# EAGLE board NS_Integrator (EAGLE 9.5.1), part 1 of 2
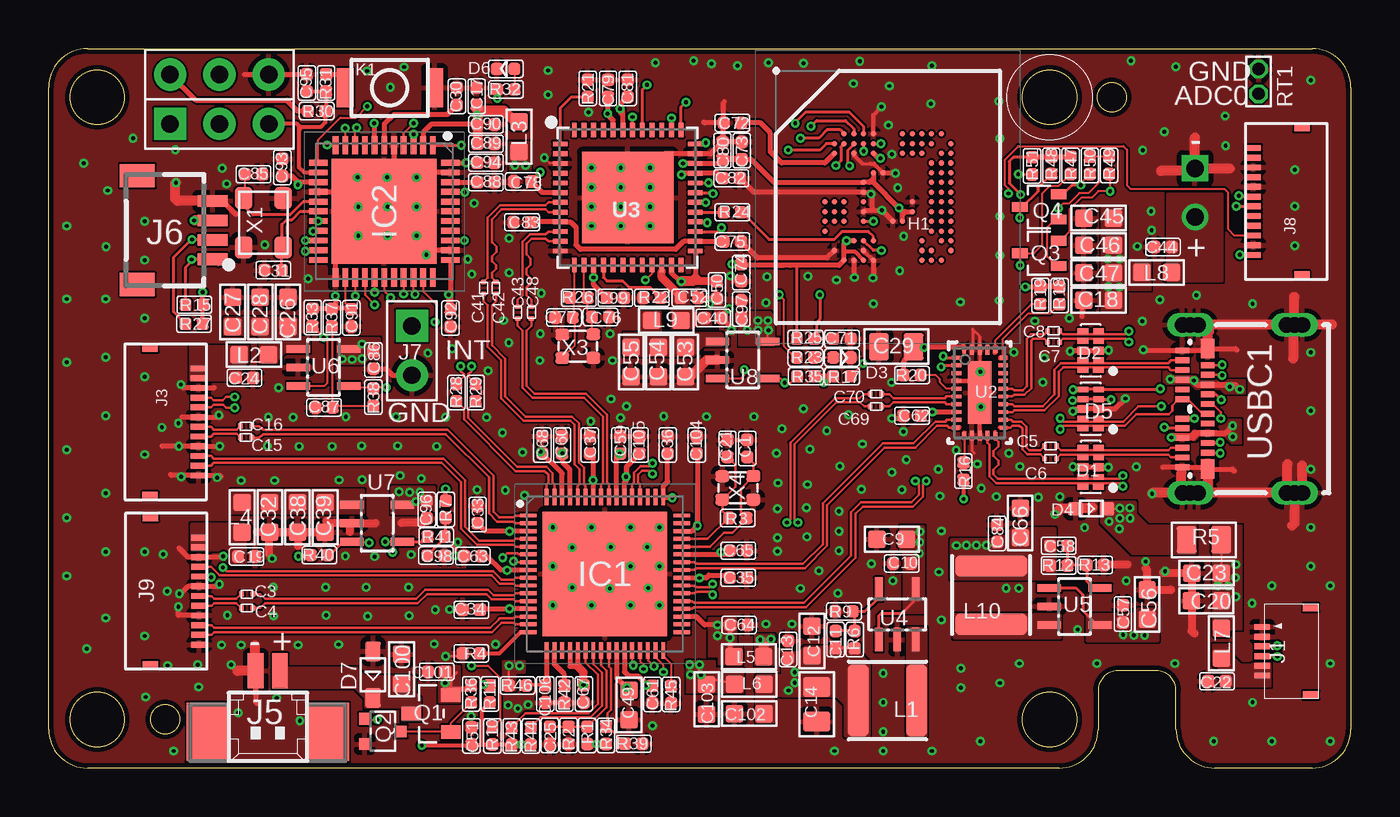
[diagram p4: board, top side]
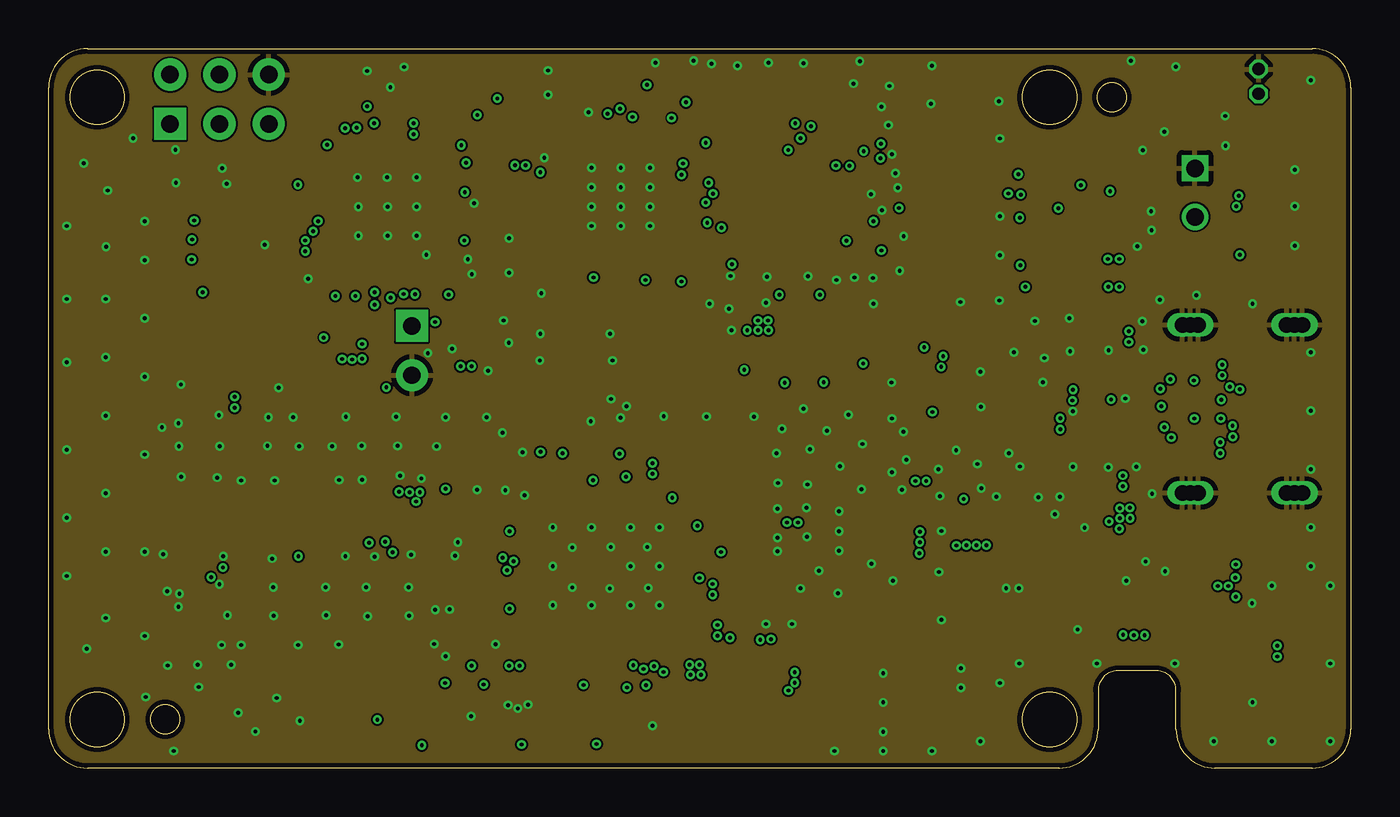
[diagram p5: board, inner layer Route2]
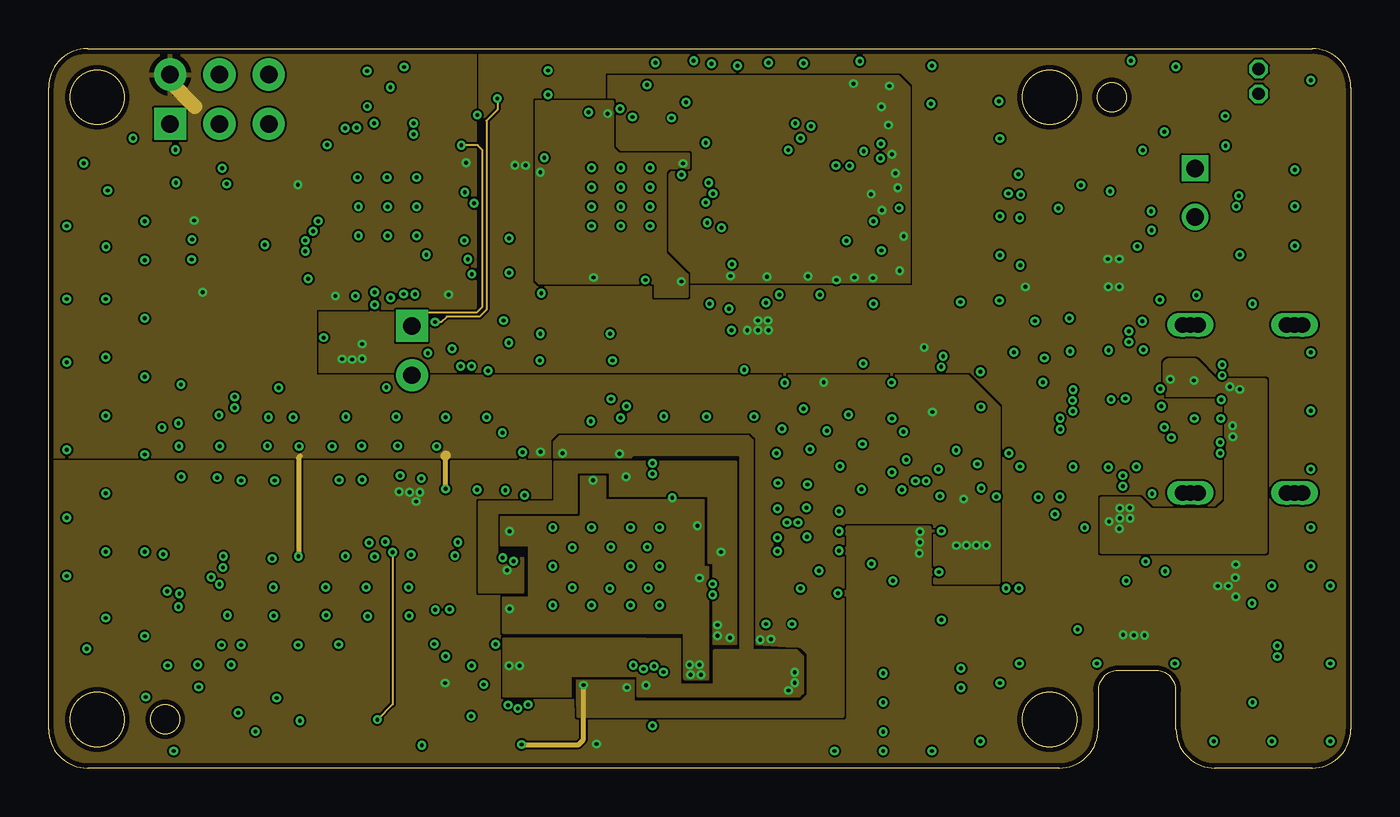
[diagram p6: board, inner layer Route15]
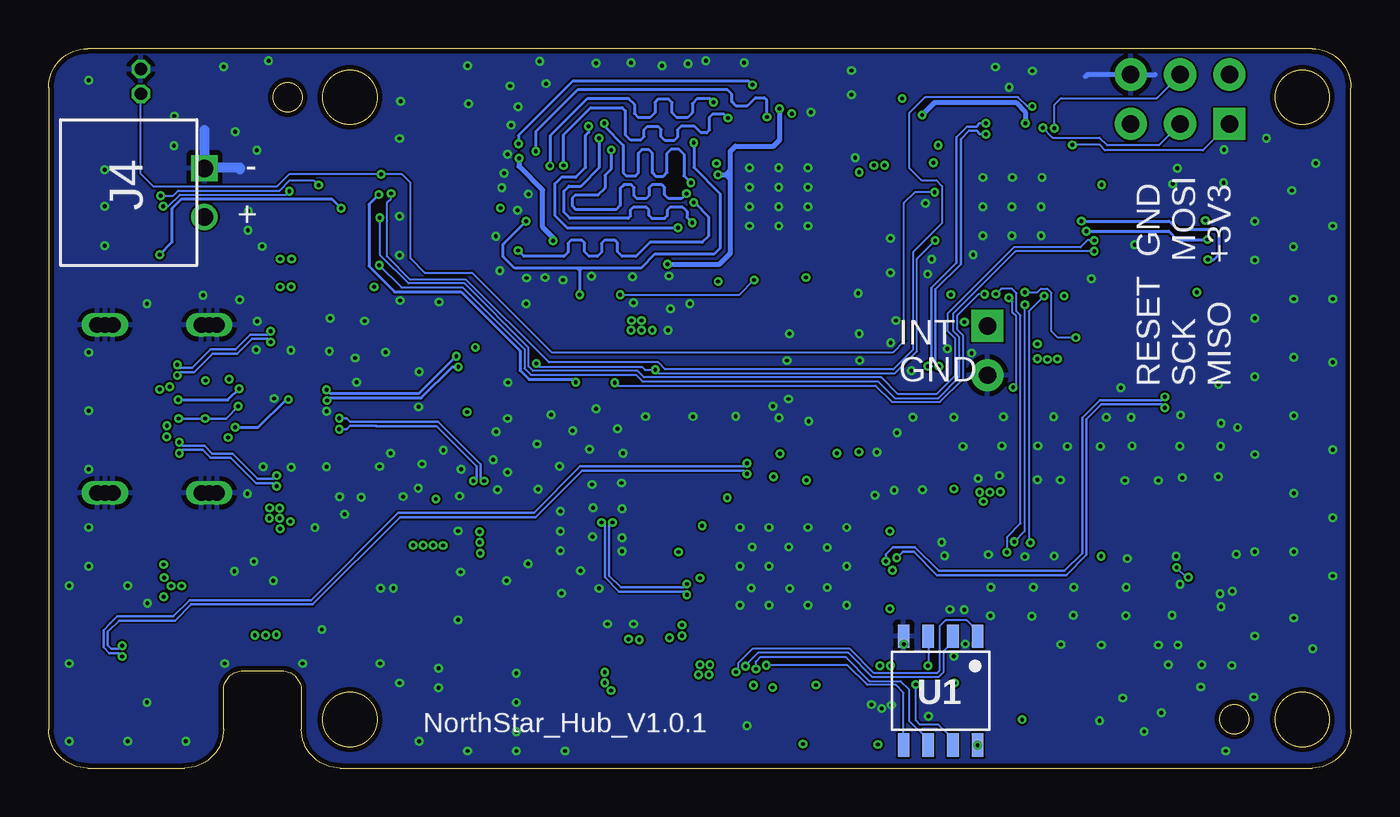
[diagram p7: board, bottom side, seen from below]

Size 67 x 37 mm. Coordinates in mm from the lower left corner, seen from the top.
Outline: 58,2 arc90 60,0 65,0 arc90 67,2 67,35 arc90 65,37 2,37 arc90 0,35 0,2 arc90 2,0 52,0 arc90 54,2 54,4 arc-90 55,5 57,5 arc-90 58,4 58,2
Outline: circle at 6,2.5 radius 0.75
Outline: circle at 54.7,34.5 radius 0.75
Outline: circle at 2.5,34.5 radius 1.4
Outline: circle at 51.5,2.5 radius 1.4
Outline: circle at 2.5,2.5 radius 1.4
Outline: circle at 51.5,34.5 radius 1.4
Copper layers (1*2+15*16): Top 0.035mm / dielectric 0.2mm / Route2 0.0175mm / dielectric 0.465mm / Route15 0.0175mm / dielectric 0.2mm / Bottom 0.035mm
Design rules "Eagle Rule_4layer *": minimum track width 4mil, minimum drill 0.2mm, track to track 4mil, track to pad 4mil, pad to pad 4mil, via to via 4mil, smd to smd 0mil, copper to edge 10mil, drill to drill 12mil, minimum pad ring 5mil, minimum via ring 5mil, stop-mask expansion 2mil, vias tented up to drill 25mil, thermal gap 10mil
Net classes: 0 Normal: width 0.102 mm, drill 0.2 mm, clearance 0.102 mm; 1 DATA: width 0.147 mm, drill 0.2 mm, clearance 0.305 mm to class 0, clearance 0.305 mm; 2 Diff: width 0.117 mm, drill 0.2 mm, clearance 0.305 mm to class 0, clearance 0.305 mm to class 1, clearance 0.102 mm; 3 CLK: width 0.147 mm, drill 0.2 mm, clearance 0.61 mm to class 0, clearance 0.61 mm to class 1, clearance 0.61 mm to class 2, clearance 0.61 mm; 4 CMD: width 0.147 mm, drill 0.2 mm, clearance 0.457 mm to class 0, clearance 0.457 mm to class 1, clearance 0.457 mm to class 2, clearance 0.457 mm to class 3, clearance 0.457 mm

## Footprints (pad centres in the part's own frame; a part is rotated, then mirrored left to right if it is on the bottom)
C0402 = smd 0.635 x 0.635: 1 -0.445,0; 2 0.445,0
C0201 = smd 0.25 x 0.3: 1 -0.3,0; 2 0.3,0
C0603 = smd 0.889 x 0.889: 1 -0.762,0; 2 0.762,0
C0805 = smd 1.016 x 1.397: 1 -0.889,0; 2 0.889,0
USON-10_L2.5-W1.0-P0.50-BL = smd 0.3 x 0.55: 1 -1.001,-0.398; 2 -0.501,-0.4; 4 0.499,-0.4; 5 1.001,-0.4; 6 0.999,0.4; 7 0.5,0.4; 9 -0.5,0.4; 10 -1.001,0.4 | smd 0.4 x 0.55: 3 -0.002,-0.4; 8 -0.001,0.4
0402_LED = smd 0.635 x 0.635: 1 -0.445,0; 2 0.445,0
SOD523 = smd 0.762 x 0.7: + 0.8,0; - -0.8,0
SOD323 = smd 1 x 0.8: + -1.2,0; - 1.2,0
BGA153C50P14X14_11.5X13 = smd 0.29 x 0.29: A3 -2.25,3.25; A4 -1.75,3.25; A5 -1.25,3.25; A6 -0.75,3.25; A9 0.75,3.25; A10 1.25,3.25; A11 1.75,3.25; A12 2.25,3.25; A13 2.75,3.25; B2 -2.75,2.75; B3 -2.25,2.75; B4 -1.75,2.75; B5 -1.25,2.75; B6 -0.75,2.75; B9 0.75,2.75; B10 1.25,2.75; B11 1.75,2.75; B12 2.25,2.75; B14 3.25,2.75; C2 -2.75,2.25; C4 -1.75,2.25; C6 -0.75,2.25; C9 0.75,2.25; C10 1.25,2.25; C11 1.75,2.25; C13 2.75,2.25; C14 3.25,2.25; D12 2.25,1.75; D13 2.75,1.75; D14 3.25,1.75; E6 -0.75,1.25; E7 -0.25,1.25; E12 2.25,1.25; E13 2.75,1.25; E14 3.25,1.25; F5 -1.25,0.75; F12 2.25,0.75; F13 2.75,0.75; F14 3.25,0.75; G5 -1.25,0.25; G12 2.25,0.25; G13 2.75,0.25; G14 3.25,0.25; H1 -3.25,-0.25; H2 -2.75,-0.25; H3 -2.25,-0.25; H5 -1.25,-0.25; H10 1.25,-0.25; H12 2.25,-0.25; H13 2.75,-0.25; H14 3.25,-0.25; J1 -3.25,-0.75; J2 -2.75,-0.75; J3 -2.25,-0.75; J5 -1.25,-0.75; J10 1.25,-0.75; J12 2.25,-0.75; J13 2.75,-0.75; J14 3.25,-0.75; K1 -3.25,-1.25; K2 -2.75,-1.25; K3 -2.25,-1.25; K5 -1.25,-1.25; K8 0.25,-1.25; K9 0.75,-1.25; K12 2.25,-1.25; K13 2.75,-1.25; K14 3.25,-1.25; L1 -3.25,-1.75; L12 2.25,-1.75; L13 2.75,-1.75; L14 3.25,-1.75; M4 -1.75,-2.25; M5 -1.25,-2.25; M6 -0.75,-2.25; M11 1.75,-2.25; M13 2.75,-2.25; M14 3.25,-2.25; N2 -2.75,-2.75; N5 -1.25,-2.75; N11 1.75,-2.75; N12 2.25,-2.75; N14 3.25,-2.75; P3 -2.25,-3.25; P4 -1.75,-3.25; P5 -1.25,-3.25; P6 -0.75,-3.25; P11 1.75,-3.25; P12 2.25,-3.25; P13 2.75,-3.25
QFN40P800X800X80-65N = smd 0.85 x 0.2: 1 -3.95,3; 2 -3.95,2.6; 3 -3.95,2.2; 4 -3.95,1.8; 5 -3.95,1.4; 6 -3.95,1; 7 -3.95,0.6; 8 -3.95,0.2; 9 -3.95,-0.2; 10 -3.95,-0.6; 11 -3.95,-1; 12 -3.95,-1.4; 13 -3.95,-1.8; 14 -3.95,-2.2; 15 -3.95,-2.6; 16 -3.95,-3; 33 3.95,-3; 34 3.95,-2.6; 35 3.95,-2.2; 36 3.95,-1.8; 37 3.95,-1.4; 38 3.95,-1; 39 3.95,-0.6; 40 3.95,-0.2; 41 3.95,0.2; 42 3.95,0.6; 43 3.95,1; 44 3.95,1.4; 45 3.95,1.8; 46 3.95,2.2; 47 3.95,2.6; 48 3.95,3 | smd 0.2 x 0.85: 17 -3,-3.95; 18 -2.6,-3.95; 19 -2.2,-3.95; 20 -1.8,-3.95; 21 -1.4,-3.95; 22 -1,-3.95; 23 -0.6,-3.95; 24 -0.2,-3.95; 25 0.2,-3.95; 26 0.6,-3.95; 27 1,-3.95; 28 1.4,-3.95; 29 1.8,-3.95; 30 2.2,-3.95; 31 2.6,-3.95; 32 3,-3.95; 49 3,3.95; 50 2.6,3.95; 51 2.2,3.95; 52 1.8,3.95; 53 1.4,3.95; 54 1,3.95; 55 0.6,3.95; 56 0.2,3.95; 57 -0.2,3.95; 58 -0.6,3.95; 59 -1,3.95; 60 -1.4,3.95; 61 -1.8,3.95; 62 -2.2,3.95; 63 -2.6,3.95; 64 -3,3.95 | smd 6.4 x 6.4: 65 0,0
QFN50P700X700X100-45N = smd 0.95 x 0.3: 1 -3.4,2.5; 2 -3.4,2; 3 -3.4,1.5; 4 -3.4,1; 5 -3.4,0.5; 6 -3.4,0; 7 -3.4,-0.5; 8 -3.4,-1; 9 -3.4,-1.5; 10 -3.4,-2; 11 -3.4,-2.5; 23 3.4,-2.5; 24 3.4,-2; 25 3.4,-1.5; 26 3.4,-1; 27 3.4,-0.5; 28 3.4,0; 29 3.4,0.5; 30 3.4,1; 31 3.4,1.5; 32 3.4,2; 33 3.4,2.5 | smd 0.3 x 0.95: 12 -2.5,-3.4; 13 -2,-3.4; 14 -1.5,-3.4; 15 -1,-3.4; 16 -0.5,-3.4; 17 0,-3.4; 18 0.5,-3.4; 19 1,-3.4; 20 1.5,-3.4; 21 2,-3.4; 22 2.5,-3.4; 34 2.5,3.4; 35 2,3.4; 36 1.5,3.4; 37 1,3.4; 38 0.5,3.4; 39 0,3.4; 40 -0.5,3.4; 41 -1,3.4; 42 -1.5,3.4; 43 -2,3.4; 44 -2.5,3.4 | smd 5.4 x 5.4: 45 0,0
FH34RJ-6S = smd 0.3 x 0.8: 1 1.25,0; 2 0.75,0; 3 0.25,0; 4 -0.25,0; 5 -0.75,0; 6 -1.25,0 | smd 0.4 x 0.8: MH1 -2.25,-2.5; MH2 2.25,-2.5
FPC-0.5-12P = smd 0.3 x 0.8: 1 -2.75,0; 2 -2.25,0; 3 -1.75,0; 4 -1.25,0; 5 -0.75,0; 6 -0.25,0; 7 0.25,0; 8 0.75,0; 9 1.25,0; 10 1.75,0; 11 2.25,0; 12 2.75,0 | smd 0.4 x 0.8: P$13 -3.8,-2.5; P$14 3.8,-2.5
XH-02-90 = drill 0.9 square: 1 1.25,0 | drill 0.9: 2 -1.25,0
53398-02 = smd 0.8 x 1.8: 1 0.625,-2.5; 2 -0.625,-2.5 | smd 2.1 x 3: S1 3.125,0.625; S2 -3.125,0.625
SM04B-SRSS-TB = smd 0.6 x 1.55: 1 -1.5,2.975; 2 -0.5,2.975; 3 0.5,2.975; 4 1.5,2.975 | smd 1.2 x 1.8: FIT@1 -2.8,-0.9; FIT@2 2.8,-0.9
2P-2.54-65/35MIL = drill 0.889 pad 1.651 square: 1 0,1.27 | drill 0.889 pad 1.651: 2 0,-1.27
2X3P-2.54-65/35MIL = drill 0.889 pad 1.651 square: 1 -1.27,2.54 | drill 0.889 pad 1.651: 2 -1.27,0; 3 -1.27,-2.54; 4 1.27,-2.54; 5 1.27,0; 6 1.27,2.54
SKRKAEE020 = smd 0.87 x 2: 1 -2.3,0; 2 2.3,0
L4012 = smd 1.1 x 3.7: 1 -1.5,0; 2 1.5,0
L0603 = smd 0.889 x 0.889: 1 -0.762,0; 2 0.762,0
SOT23 = smd 0.7 x 1: 1 -0.95,-1.016; 2 0.95,-1.016; 3 0,1.016
SOT323 = smd 0.6 x 0.6: 1 -0.65,-0.925; 2 0.65,-0.925; 3 0,0.925
SOT-323 = smd 0.5 x 0.8: 1 0.65,-0.2; 2 -0.65,-0.2; 3 0,-2.2
R0402 = smd 0.635 x 0.635: 1 -0.445,0; 2 0.445,0
R0805 = smd 1.016 x 1.397: 1 -0.889,0; 2 0.889,0
2P-1.27 = drill 0.635 pad 0.889 octagon: 1 0,0.635; 2 0,-0.635
SOIC8-6.0 = smd 0.6 x 1.2: 1 -1.905,-2.8; 2 -0.635,-2.8; 3 0.635,-2.8; 4 1.905,-2.8; 5 1.905,2.8; 6 0.635,2.8; 7 -0.635,2.8; 8 -1.905,2.8
RNH0030A = smd 0.3 x 0.2: 1 -1.2,1.8; 10 -1.2,-1.8; 16 1.2,-1.8; 25 1.2,1.8 | smd 0.5 x 0.2: 2 -1.2,1.4; 3 -1.2,1; 4 -1.2,0.6; 5 -1.2,0.2; 6 -1.2,-0.2; 7 -1.2,-0.6; 8 -1.2,-1; 9 -1.2,-1.4; 17 1.2,-1.4; 18 1.2,-1; 19 1.2,-0.6; 20 1.2,-0.2; 21 1.2,0.2; 22 1.2,0.6; 23 1.2,1; 24 1.2,1.4 | smd 0.2 x 0.3: 11 -0.8,-2.2; 15 0.8,-2.2; 26 0.8,2.2; 30 -0.8,2.2 | smd 0.2 x 0.5: 12 -0.4,-2.2; 13 0,-2.2; 14 0.4,-2.2; 27 0.4,2.2; 28 0,2.2; 29 -0.4,2.2 | smd 1.2 x 3.2: 31 0,0
TQFN48_7MM = smd 0.25 x 0.75: 1 -2.75,-3.475; 2 -2.25,-3.475; 3 -1.75,-3.475; 4 -1.25,-3.475; 5 -0.75,-3.475; 6 -0.25,-3.475; 7 0.25,-3.475; 8 0.75,-3.475; 9 1.25,-3.475; 10 1.75,-3.475; 11 2.25,-3.475; 12 2.75,-3.475; 25 2.75,3.475; 26 2.25,3.475; 27 1.75,3.475; 28 1.25,3.475; 29 0.75,3.475; 30 0.25,3.475; 31 -0.25,3.475; 32 -0.75,3.475; 33 -1.25,3.475; 34 -1.75,3.475; 35 -2.25,3.475; 36 -2.75,3.475 | smd 0.75 x 0.25: 13 3.475,-2.75; 14 3.475,-2.25; 15 3.475,-1.75; 16 3.475,-1.25; 17 3.475,-0.75; 18 3.475,-0.25; 19 3.475,0.25; 20 3.475,0.75; 21 3.475,1.25; 22 3.475,1.75; 23 3.475,2.25; 24 3.475,2.75; 37 -3.475,2.75; 38 -3.475,2.25; 39 -3.475,1.75; 40 -3.475,1.25; 41 -3.475,0.75; 42 -3.475,0.25; 43 -3.475,-0.25; 44 -3.475,-0.75; 45 -3.475,-1.25; 46 -3.475,-1.75; 47 -3.475,-2.25; 48 -3.475,-2.75 | smd 4.7 x 4.7: THERMAL 0,0
SOT23-5 = smd 0.4 x 1.2: 1 -0.95,-1.3; 2 0,-1.3; 3 0.95,-1.3; 4 0.95,1.3; 5 -0.95,1.3
USB-C-SMD_TYPE-C-USB-18 = drill 0.8 pad 1.2 long: 0 4.32,2.475; 0-1 -4.32,2.475; 0-2 -4.32,-2.885; 0-3 4.32,-2.885 | drill 0.8 pad 1.2: 0-4 -4.32,2.875; 0-5 -4.32,2.075; 0-6 -4.32,-2.485; 0-7 -4.32,-3.285; 0-8 4.32,-2.485; 0-9 4.32,-3.285; 1 4.32,2.875; 2 4.32,2.075 | smd 0.3 x 0.7: A1 -2.998,2.885; A2 -2.498,2.885; A3 -1.998,2.885; A4 -1.496,2.885; A5 -0.996,2.885; A6 -0.5,2.885; A7 0.504,2.885; A8 1,2.885; A9 1.5,2.885; A10 2,2.885; A11 2.5,2.885; A12 3,2.885; B2 2.25,1.585; B3 1.75,1.585; B4 1.25,1.585; B5 0.75,1.585; B6 0.25,1.585; B7 -0.25,1.585; B8 -0.75,1.585; B9 -1.25,1.585; B10 -1.75,1.585; B11 -2.25,1.585 | smd 1 x 0.7: B1 3.1,1.585; B12 -3.1,1.585
4P-SMD-3.2X2.5 = smd 0.889 x 1.143: 1 1.016,1.27; 2 -1.016,1.27; 3 -1.016,-1.27; 4 1.016,-1.27
4P-SMD-2X1.6MM = smd 0.7 x 0.6: 1 -0.8,0.6; 2 -0.8,-0.6; 3 0.8,-0.6; 4 0.8,0.616

## Placement (x,y rotation side)
C1  20pF ±5% 50V  [C0402]  35.94,16.44 90 top
C3  100nF ±10% 10V  [C0201]  10.21,8.95 180 top
C4  100nF ±10% 10V  [C0201]  10.21,8.23 180 top
C5  100nF ±10% 10V  [C0201]  51.55,16.57 180 top
C6  100nF ±10% 10V  [C0201]  51.55,15.91 180 top
C7  100nF ±10% 10V  [C0201]  51.7,21.9 180 top
C8  100nF ±10% 10V  [C0201]  51.7,22.48 180 top
C9  4.7uF ±10% 10V  [C0603]  43.38,11.76 0 top
C10  100nF ±10% 10V  [C0402]  43.89,10.52 0 top
C11  56pF ±5% 50V  [C0402]  40.49,6.61 270 top
C12  10uF ±10% 10V  [C0603]  39.27,6.53 270 top
C13  100nF ±10% 10V  [C0402]  38.05,6.1 270 top
C14  22uF ±20% 10V  [C0805]  39.52,3.28 90 top
C15  100nF ±10% 10V  [C0201]  10.16,17 180 top
C16  100nF ±10% 10V  [C0201]  10.16,17.58 180 top
C17  100nF ±10% 10V  [C0402]  22.02,34.55 90 top
C18  22uF ±20% 10V  [C0603]  54.03,24.06 0 top
C19  100nF ±10% 10V  [C0402]  10.18,10.88 0 top
C20  22uF ±20% 10V  [C0603]  59.56,8.6 0 top
C21  20pF ±5% 50V  [C0402]  34.92,16.44 90 top
C22  100nF ±10% 10V  [C0402]  60.11,4.46 180 top
C23  22uF ±20% 10V  [C0603]  59.58,10.02 0 top
C24  100nF ±10% 10V  [C0402]  10.08,20.07 0 top
C25  1uF ±10% 10V  [C0402]  25.78,1.68 270 top
C26  22uF ±20% 10V  [C0603]  12.32,23.45 270 top
C27  22uF ±20% 10V  [C0603]  9.47,23.45 270 top
C28  22uF ±20% 10V  [C0603]  10.9,23.45 270 top
C29  22uF ±20% 10V  [C0805]  43.61,21.67 180 top
C30  1uF ±10% 10V  [C0402]  21.01,34.55 90 top
C31  22pF ±5% 50V  [C0402]  11.56,25.61 180 top
C32  22uF ±20% 10V  [C0603]  11.38,12.9 90 top
C33  100nF ±10% 10V  [C0402]  22.07,13.03 90 top
C34  100nF ±10% 10V  [C0402]  21.75,8.15 180 top
C35  100nF ±10% 10V  [C0402]  35.48,9.78 0 top
C36  100nF ±10% 10V  [C0402]  31.85,16.62 90 top
C37  100nF ±10% 10V  [C0402]  27.84,16.62 90 top
C38  22uF ±20% 10V  [C0603]  12.8,12.9 90 top
C39  22uF ±20% 10V  [C0603]  14.22,12.9 90 top
C40  2.2uF ±10% 10V  [C0402]  34.19,23.14 180 top
C41  100nF ±10% 10V  [C0201]  22.38,24.69 90 top
C42  100nF ±10% 10V  [C0201]  23.01,24.69 90 top
C43  100nF ±10% 10V  [C0201]  24.13,23.42 270 top
C44  100nF ±10% 10V  [C0402]  57.33,26.8 180 top
C45  22uF ±20% 10V  [C0603]  54.03,28.29 0 top
C46  22uF ±20% 10V  [C0603]  54.03,26.88 0 top
C47  22uF ±20% 10V  [C0603]  54.03,25.47 0 top
C48  100nF ±10% 10V  [C0201]  24.84,23.42 270 top
C49  10uF ±10% 10V  [C0603]  29.86,3.24 270 top
C50  2.2uF ±10% 10V  [C0402]  34.39,24.59 90 top
C51  NA/100nF ±10% 10V  [C0402]  21.75,1.66 270 top
C52  100nF ±10% 10V  [C0402]  32.97,24.19 0 top
C53  22uF ±20% 10V  [C0603]  32.77,20.88 90 top
C54  22uF ±20% 10V  [C0603]  31.37,20.88 90 top
C55  22uF ±20% 10V  [C0603]  29.97,20.88 90 top
C56  4.7uF ±10% 10V  [C0603]  56.51,8.41 270 top
C57  100nF ±10% 10V  [C0402]  55.27,7.93 270 top
C58  56pF ±5% 50V  [C0402]  51.97,11.43 180 top
C59  100nF ±10% 10V  [C0402]  29.41,16.62 90 top
C60  100nF ±10% 10V  [C0402]  26.42,16.62 90 top
C61  100nF ±10% 10V  [C0402]  31.06,3.79 270 top
C62  100nF ±10% 10V  [C0402]  44.42,18.11 0 top
C63  100nF ±10% 10V  [C0402]  21.82,10.9 180 top
C64  100nF ±10% 10V  [C0402]  35.52,7.36 0 top
C65  100nF ±10% 10V  [C0402]  35.48,11.18 0 top
C66  10uF ±10% 10V  [C0603]  49.99,12.6 270 top
C67  100nF ±10% 10V  [C0402]  27.53,3.81 270 top
C68  100nF ±10% 10V  [C0402]  25.4,16.62 90 top
C69  100nF ±10% 10V  [C0201]  42.57,18.6 180 top
C70  100nF ±10% 10V  [C0201]  42.57,19.23 180 top
C71  1uF ±10% 10V  [C0402]  40.82,22.08 180 top
C72  100nF ±10% 10V  [C0402]  35.18,33.18 0 top
C73  2.2uF ±10% 10V  [C0402]  35.66,31.75 270 top
C74  2.2uF ±10% 10V  [C0402]  35.64,25.48 90 top
C75  1uF ±10% 10V  [C0402]  35.18,27.08 180 top
C76  12pF ±10% 50V  [C0402]  28.4,23.19 0 top
C77  12pF ±10% 50V  [C0402]  26.52,23.17 180 top
C78  1uF ±10% 10V  [C0402]  24.38,30.17 0 top
C79  100nF ±10% 10V  [C0402]  28.78,34.96 270 top
C80  100nF ±10% 10V  [C0402]  34.67,31.75 270 top
C81  1uF ±10% 10V  [C0402]  29.79,34.96 270 top
C82  1uF ±10% 10V  [C0402]  35.13,30.33 180 top
C83  2.2uF ±10% 10V  [C0402]  24.36,28.07 0 top
C84  100nF ±10% 10V  [C0402]  48.79,12.07 270 top
C85  22pF ±5% 50V  [C0402]  10.54,30.54 0 top
C86  100nF ±10% 10V  [C0402]  16.71,20.99 90 top
C87  2.2uF ±10% 10V  [C0402]  14.17,18.55 0 top
C88  100nF ±10% 10V  [C0402]  22.5,30.13 0 top
C89  1uF ±10% 10V  [C0402]  22.5,32.11 0 top
C90  100nF ±10% 10V  [C0402]  22.5,33.1 0 top
C91  100nF ±10% 10V  [C0402]  15.57,23.16 270 top
C92  100nF ±10% 10V  [C0402]  20.68,23.14 270 top
C93  100nF ±10% 10V  [C0402]  12.03,30.89 90 top
C94  100nF ±10% 10V  [C0402]  22.5,31.13 0 top
C95  100nF ±10% 10V  [C0402]  13.28,35.23 90 top
C96  100nF ±10% 10V  [C0402]  19.46,13.29 90 top
C97  100nF ±10% 10V  [C0402]  35.64,23.6 270 top
C98  2.2uF ±10% 10V  [C0402]  19.93,10.93 180 top
C99  1uF ±10% 10V  [C0402]  29.16,24.19 180 top
C100  10uF ±10% 10V  [C0603]  18.16,5.08 270 top
C101  100nF ±10% 10V  [C0402]  19.96,4.96 180 top
C102  10uF ±10% 10V  [C0603]  36.04,2.8 180 top
C103  10uF ±10% 10V  [C0603]  33.86,3.54 270 top
C104  100nF ±10% 10V  [C0402]  33.35,16.62 90 top
C105  100nF ±10% 10V  [C0402]  30.4,16.62 90 top
C106  100nF ±10% 10V  [C0402]  25.55,3.81 270 top
D1  TPD4E05U06DQ  [USON-10_L2.5-W1.0-P0.50-BL]  53.61,15.47 90 top
D2  TPD4E05U06DQ  [USON-10_L2.5-W1.0-P0.50-BL]  53.61,21.47 90 top
D3  BLUE  [0402_LED]  40.82,21.11 0 top
D4  ESD5Z6.0T1G  [SOD523]  53.64,13.34 180 top
D5  TPD4E05U06DQ  [USON-10_L2.5-W1.0-P0.50-BL]  53.61,18.47 90 top
D6  BLUE  [0402_LED]  23.52,35.96 180 top
D7  PMEG2010EA,115  [SOD323]  16.69,4.81 270 top
H1  THGBMNG5D1LBAIL  [BGA153C50P14X14_11.5X13]  43.18,29.37 0 top
IC1  GL3510  [QFN40P800X800X80-65N]  28.63,9.99 0 top
IC2  ATMEGA32U4-MUR  [QFN50P700X700X100-45N]  17.27,28.63 270 top
J1  FH34SRJ-6S-0.5SH(50)  [FH34RJ-6S]  62.43,6.01 90 top
J3  FH34SRJ-12S-0.5SH(50)  [FPC-0.5-12P]  7.72,17.8 270 top
J4  XH-2AW  [XH-02-90]  58.98,29.6 90 bottom
J5  53398-02  [53398-02]  11.28,2.49 180 top
J6  SM04B-SRSS-TB  [SM04B-SRSS-TB]  5.46,27.67 270 top
J7  2.54MM 单排正弯针 1*2P PA6.0  [2P-2.54-65/35MIL]  18.69,21.47 0 top
J8  FH34SRJ-12S-0.5SH(50)  [FPC-0.5-12P]  61.98,29.14 90 top
J9  FH34SRJ-12S-0.5SH(50)  [FPC-0.5-12P]  7.75,9.1 270 top
J10  NA  [2X3P-2.54-65/35MIL]  8.79,34.4 90 top
K1  SKRKAEE020  [SKRKAEE020]  17.55,34.98 0 top
L1  SMNR4012-2R2MT  [L4012]  43.15,3.48 180 top
L2  BLM18EG221SN1D  [L0603]  10.57,21.26 180 top
L3  BLM18EG221SN1D  [L0603]  24.21,32.47 90 top
L4  BLM18EG221SN1D  [L0603]  9.96,12.9 270 top
L5  BLM18EG221SN1D  [L0603]  36.03,5.72 0 top
L6  BLM18EG221SN1D  [L0603]  36.04,4.31 0 top
L7  BLM18EG221SN1D  [L0603]  60.34,6.42 270 top
L8  BLM18EG221SN1D  [L0603]  57.01,25.49 0 top
L9  BLM18EG221SN1D  [L0603]  31.77,23.02 0 top
L10  SMNR4012-2R2MT  [L4012]  48.49,8.89 90 top
Q1  CJ2301 S1  [SOT23]  19.68,2.8 90 top
Q2  DTC143ZUA  [SOT323]  17.2,1.88 270 top
Q3  BSS138W  [SOT-323]  52.17,26.47 270 top
Q4  BSS138W  [SOT-323]  52.17,28.86 270 top
R1  10K ±1%  [R0402]  27.71,1.68 90 top
R2  47K ±1%  [R0402]  26.75,1.68 270 top
R3  1M ±1%  [R0402]  35.46,12.86 180 top
R4  20K ±1%  [R0402]  21.74,5.9 0 top
R5  0R ±1%  [R0805]  59.44,11.74 0 top
R6  100K ±1%  [R0402]  41.48,6.61 90 top
R7  3.6M ±1%  [R0402]  20.43,13.3 270 top
R9  100K ±1%  [R0402]  40.92,8.06 180 top
R10  NA/10K ±1%  [R0402]  22.83,1.66 90 top
R11  NA/10K ±1%  [R0402]  22.71,3.81 270 top
R12  470K ±1%  [R0402]  51.97,10.42 0 top
R13  107K ±1%  [R0402]  53.85,10.44 0 top
R15  4.7K ±1%  [R0402]  7.49,23.83 180 top
R16  200K ±1%  [R0402]  47.07,15.27 270 top
R17  10K ±1%  [R0402]  40.82,20.15 0 top
R18  200K ±1%  [R0402]  52.02,24.3 90 top
R19  200K ±1%  [R0402]  51.03,24.3 90 top
R20  909K ±1%  [R0402]  44.42,20.21 180 top
R21  0R ±1%  [R0402]  27.74,34.96 270 top
R22  680R ±1%  [R0402]  31.04,24.19 0 top
R23  2K ±1%  [R0402]  38.94,21.11 0 top
R24  47R ±1%  [R0402]  35.18,28.58 0 top
R25  51K ±1%  [R0402]  38.94,22.08 0 top
R26  1M ±1%  [R0402]  27.28,24.19 180 top
R27  4.7K ±1%  [R0402]  7.48,22.85 180 top
R28  22R ±1%  [R0402]  20.98,19.31 90 top
R29  22R ±1%  [R0402]  21.97,19.31 90 top
R30  4.7K ±1%  [R0402]  13.79,33.79 180 top
R31  220R ±1%  [R0402]  14.27,35.23 90 top
R32  2K ±1%  [R0402]  23.53,34.9 0 top
R33  10K ±1%  [R0402]  13.59,23.18 270 top
R34  51K ±1%  [R0402]  28.68,1.68 270 top
R35  10K ±1%  [R0402]  38.96,20.15 180 top
R36  100K ±1%  [R0402]  21.74,3.81 90 top
R37  3.6M ±1%  [R0402]  14.58,23.17 90 top
R38  0R ±1%  [R0402]  16.71,19.08 270 top
R39  100K ±1%  [R0402]  30.1,1.25 180 top
R40  10K ±1%  [R0402]  13.93,10.95 0 top
R41  0R ±1%  [R0402]  19.94,11.9 180 top
R42  0R ±1%  [R0402]  26.54,3.81 90 top
R43  10K ±1%  [R0402]  23.82,1.66 90 top
R44  10K ±1%  [R0402]  24.82,1.66 90 top
R45  10K ±1%  [R0402]  32.03,3.79 90 top
R46  0R ±1%  [R0402]  24.13,4.25 0 top
R47  4.7K ±1%  [R0402]  52.58,30.99 270 top
R48  4.7K ±1%  [R0402]  51.59,30.99 270 top
R49  4.7K ±1%  [R0402]  54.56,30.99 270 top
R50  4.7K ±1%  [R0402]  53.57,30.99 270 top
R51  4.7K ±1%  [R0402]  50.6,30.97 270 top
RT1  MF52B 103F3950-100mm  [2P-1.27]  62.25,35.31 180 top
U1  AT25DF512C-MAHN-T  [SOIC8-6.0]  21.11,3.98 180 bottom
U2  HD3SS3220IRNHR  [RNH0030A]  47.9,19.31 0 top
U3  GL3224E  [TQFN48_7MM]  29.79,29.34 270 top
U4  SY8089  [SOT23-5]  43.66,7.9 0 top
U5  SY8089  [SOT23-5]  52.78,8.31 270 top
U6  TPS2065C  [SOT23-5]  14.15,20.6 270 top
U7  TPS2065C  [SOT23-5]  16.9,12.59 270 top
U8  TPS2065C  [SOT23-5]  35.71,20.99 270 top
USBC1  1054500101  [USB-C-SMD_TYPE-C-USB-18]  61.21,18.47 90 top
X1  16MHZ  [4P-SMD-3.2X2.5]  11.05,28.05 180 top
X3  25MHZ  [4P-SMD-2X1.6MM]  27.23,21.7 0 top
X4  25MHZ  [4P-SMD-2X1.6MM]  35.46,14.41 0 top